# Altium schematic sheet larduino.SchDoc
size A4
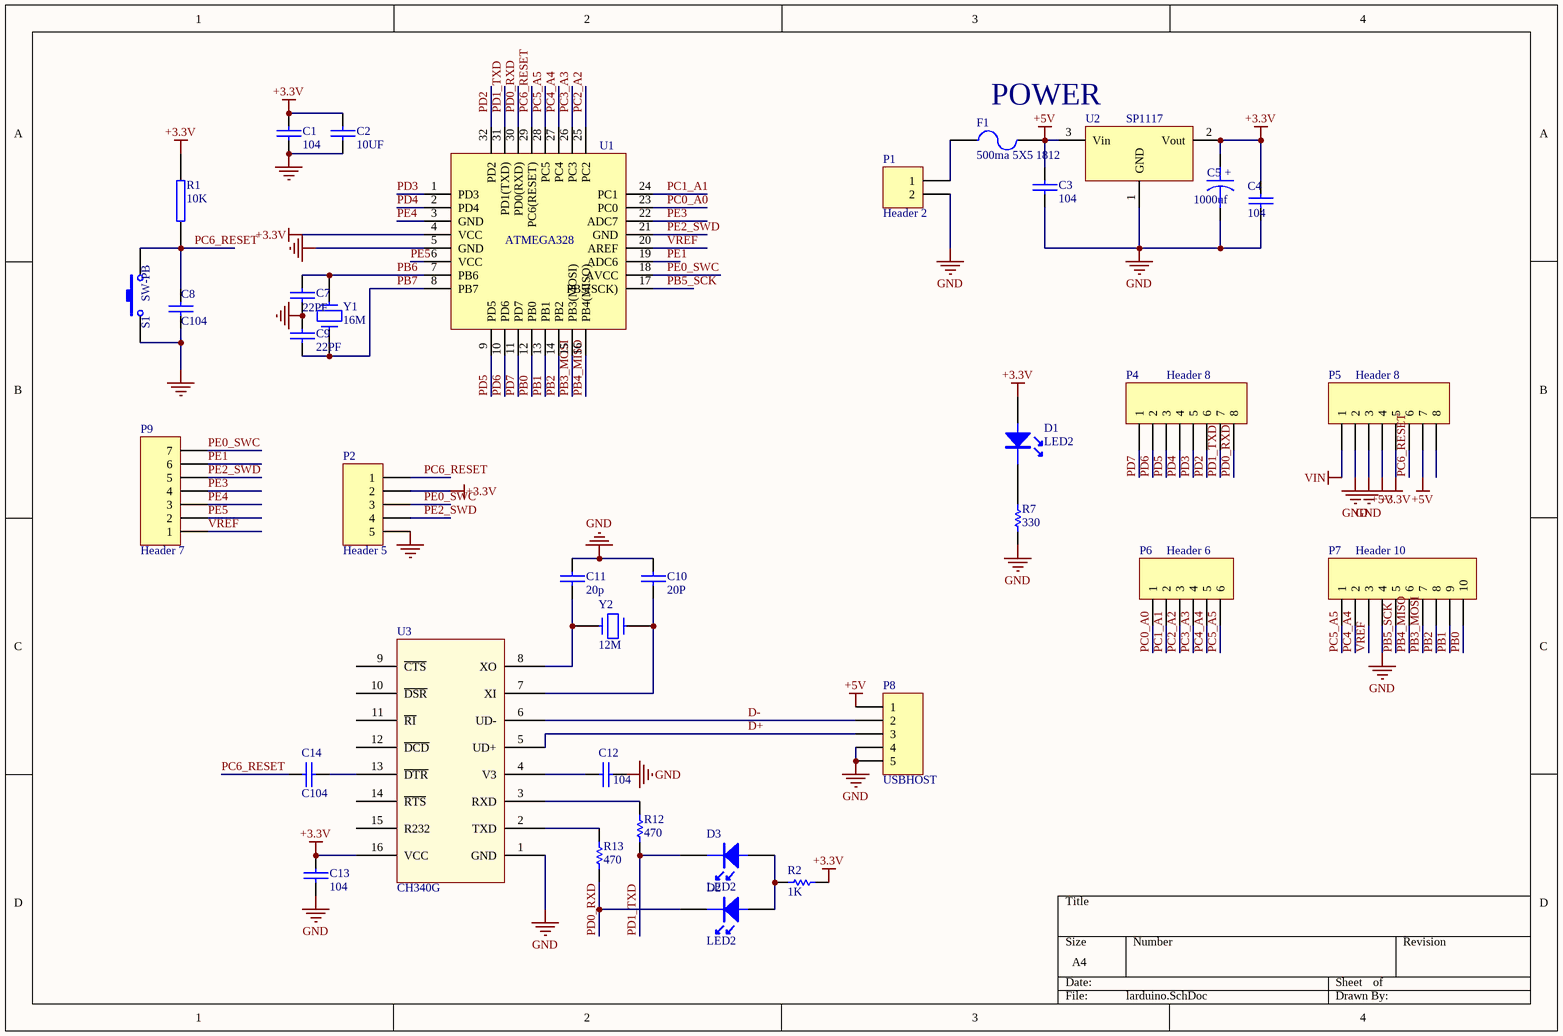
[diagram p0: larduino.SchDoc]

## Parts
C1  104  [0805C1]
C2  10UF  [0805C1]
C3  104  [0805C1]
C4  104  [0805C1]
C5  1000uf  [c6.3*5.3]
C7  22PF  [0805C1]
C8  C104  [0805C1]
C9  22PF  [0805C1]
C10  20P  [0805C1]
C11  20p  [0805C1]
C12  104  [0805C1]
C13  104  [0805C1]
C14  C104  [0805C1]
D1  LED2  [0805LED]
D2  LED2  [0805LED]
D3  LED2  [0805LED]
F1  500ma 5X5 1812  [1812R]
P1  Header 2  [5VINPUT]
P2  Header 5  [HDR1X5]
P4  Header 8  [HDR1X8]
P5  Header 8  [HDR1X8]
P6  Header 6  [HDR1X6]
P7  Header 10  [HDR1X10]
P8  USBHOST  [USB_mini]
P9  Header 7  [HDR1X7]
R1  10K  [0805R1]
R2  value 1K  [0805R1]  (hidden comment: Res Semi)
R7  value 330  [0805R1]  (hidden comment: Res1)
R12  value 470  [0805R1]  (hidden comment: Res Semi)
R13  value 470  [0805R1]  (hidden comment: Res Semi)
S1  SW-PB  [KEY_6*6*X _SMT]
U1  ATMEGA328  [TQFP32]
U2  SP1117  [SOT-223]
U3  CH340G  [SO-16]
Y1  16M  [XTAL_smd1]
Y2  12M  [XTAL_smd1]

## Nets
+3.3V: C1.1 C2.1 C4.1 C5.1 C13.2 D1.1 P2.2 P5.5 R1.1 R2.2 U1.4(VCC) U2.2(Vout) U3.16(VCC)
+5V: C3.2 F1.2 P5.4 P5.7 P8.1 U2.3(Vin)
GND: C1.2 C2.2 C3.1 C4.2 C5.2 C7.2 C8.2 C9.1 C10.2 C11.2 C12.1 C13.1 P1.2 P2.5 P5.2 P5.3 P7.4 P8.4 P8.5 R7.2 S1.2 U1.5(GND) U2.1(GND) U3.1(GND)
VIN: P5.1
D+: P8.3 U3.5(UD+)
D-: P8.2 U3.6(UD-)
PB0: P7.10 U1.12(PB0)
PB1: P7.9 U1.13(PB1)
PB2: P7.8 U1.14(PB2)
PB3_MOSI: P7.7 U1.15(PB3(MOSI))
PB4_MISO: P7.6 U1.16(PB4(MISO))
PB5_SCK: P7.5 U1.17(PB5(SCK))
PB6: C7.1 U1.7(PB6) Y1.1
PB7: C9.2 U1.8(PB7) Y1.2
PC0_A0: P6.1 U1.23(PC0)
PC1_A1: P6.2 U1.24(PC1)
PC2_A2: P6.3 U1.25(PC2)
PC3_A3: P6.4 U1.26(PC3)
PC4_A4: P6.5 P7.2 U1.27(PC4)
PC5_A5: P6.6 P7.1 U1.28(PC5)
PC6_RESET: C8.1 C14.1 P2.1 P5.6 R1.2 S1.1 U1.29(PC6(RESET))
PD0_RXD: D2.2 P4.8 R13.2 U1.30(PD0(RXD))
PD1_TXD: D3.2 P4.7 R12.2 U1.31(PD1(TXD))
PD2: P4.6 U1.32(PD2)
PD3: P4.5 U1.1(PD3)
PD4: P4.4 U1.2(PD4)
PD5: P4.3 U1.9(PD5)
PD6: P4.2 U1.10(PD6)
PD7: P4.1 U1.11(PD7)
PE0_SWC: P2.3 P9.7 U1.18(AVCC)
PE1: P9.6 U1.19(ADC6)
PE2_SWD: P2.4 P9.5 U1.21(GND)
PE3: P9.4 U1.22(ADC7)
PE4: P9.3 U1.3(GND)
PE5: P9.2 U1.6(VCC)
VREF: P7.3 P9.1 U1.20(AREF)
NetC10_1: C10.1 U3.7(XI) Y2.1
NetC11_1: C11.1 U3.8(XO) Y2.2
NetC12_2: C12.2 U3.4(V3)
NetC14_2: C14.2 U3.13(~{DTR})
NetD1_2: D1.2 R7.1
NetD2_1: D2.1 D3.1 R2.1
NetF1_1: F1.1 P1.1
NetR12_1: R12.1 U3.3(RXD)
NetR13_1: R13.1 U3.2(TXD)

Not connected (* = marked no-connect by the designer): P5 8; U3 9(~{CTS}) 10(~{DSR}) 11(~{RI}) 12(~{DCD}) 14(~{RTS}) 15(R232)

## Notes on the sheet
- POWER
- (in symbol CAPACITOR POL) +

## Library data of the parts
C1-C4 C7-C14 = CAP: Capacitor
C5 = CAPACITOR POL: Capacitor
D1-D3 = LED
F1 = Fuse 2: Fuse; Published: 8-Jun-2000; LatestRevisionDate: 17-Jul-2002; LatestRevisionNote: Re-released for DXP Platform.; PackageReference: PIN-W2/E2.8; Publisher: Altium Limited; PackageDescription: Thru-Hole; 2 Leads
P1 = Header 2: Header, 2-Pin; LatestRevisionDate: 17-Jul-2002; LatestRevisionNote: Re-released for DXP Platform.; Publisher: Altium Limited
P2 P8 = Header 5: Header, 5-Pin; LatestRevisionDate: 17-Jul-2002; LatestRevisionNote: Re-released for DXP Platform.; Publisher: Altium Limited
P4 P5 = Header 8: Header, 8-Pin; LatestRevisionDate: 17-Jul-2002; LatestRevisionNote: Re-released for DXP Platform.; Publisher: Altium Limited
P6 = Header 6: Header, 6-Pin; LatestRevisionDate: 17-Jul-2002; LatestRevisionNote: Re-released for DXP Platform.; Publisher: Altium Limited
P7 = Header 10: Header, 10-Pin; LatestRevisionDate: 17-Jul-2002; LatestRevisionNote: Re-released for DXP Platform.; Publisher: Altium Limited
P9 = Header 7: Header, 7-Pin; LatestRevisionDate: 17-Jul-2002; LatestRevisionNote: Re-released for DXP Platform.; Publisher: Altium Limited
R1 = RES2
R2 R12 R13 = Res Semi: Semiconductor Resistor; Published: 8-Jun-2000; LatestRevisionDate: 17-Jul-2002; LatestRevisionNote: Re-released for DXP Platform.; PackageReference: AXIAL-0.5; Publisher: Altium Limited; PackageDescription: Axial Device, Thru-Hole; 2 Leads; 0.5 in Pin Spacing
R7 = Res1: Resistor; Published: 8-Jun-2000; LatestRevisionDate: 17-Jul-2002; LatestRevisionNote: Re-released for DXP Platform.; PackageReference: AXIAL-0.3; Publisher: Altium Limited; PackageDescription: Axial Device, Thru-Hole; 2 Leads; 0.3 in Pin Spacing
S1 = SW-PB: Switch; Published: 24-Mar-1999; LatestRevisionDate: 17-Jul-2002; LatestRevisionNote: Re-released for DXP Platform.; PackageReference: SPST-2; Publisher: Altium Limited; PackageDescription: Switch; 2 Leads
U1 = ATMEAG328
Y1 Y2 = CRYSTAL